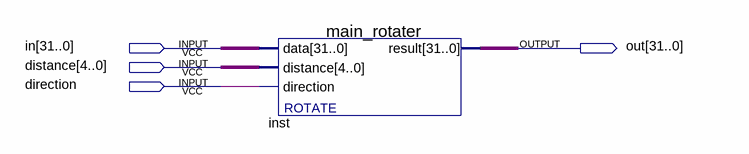
[diagram p0: schematic sheet]
// Quartus schematic rotate_left_right.bdf as structural Verilog: 1 symbols, 4 pins
module rotate_left_right (
  input  [31:0] in,
  input  [4:0] distance,
  input  direction,
  output [31:0] out
);

  main_rotater inst (.data(in), .distance(distance), .direction(direction), .result(out));
endmodule
